# EAGLE design LoRa Gateway ESP32 - Final (EAGLE 9.4.2)
COMPANY: ADAFRUIT INDUSTRIES; DRAWN: KTOWN; REV: B

## Sheet 1 of 2: ESP
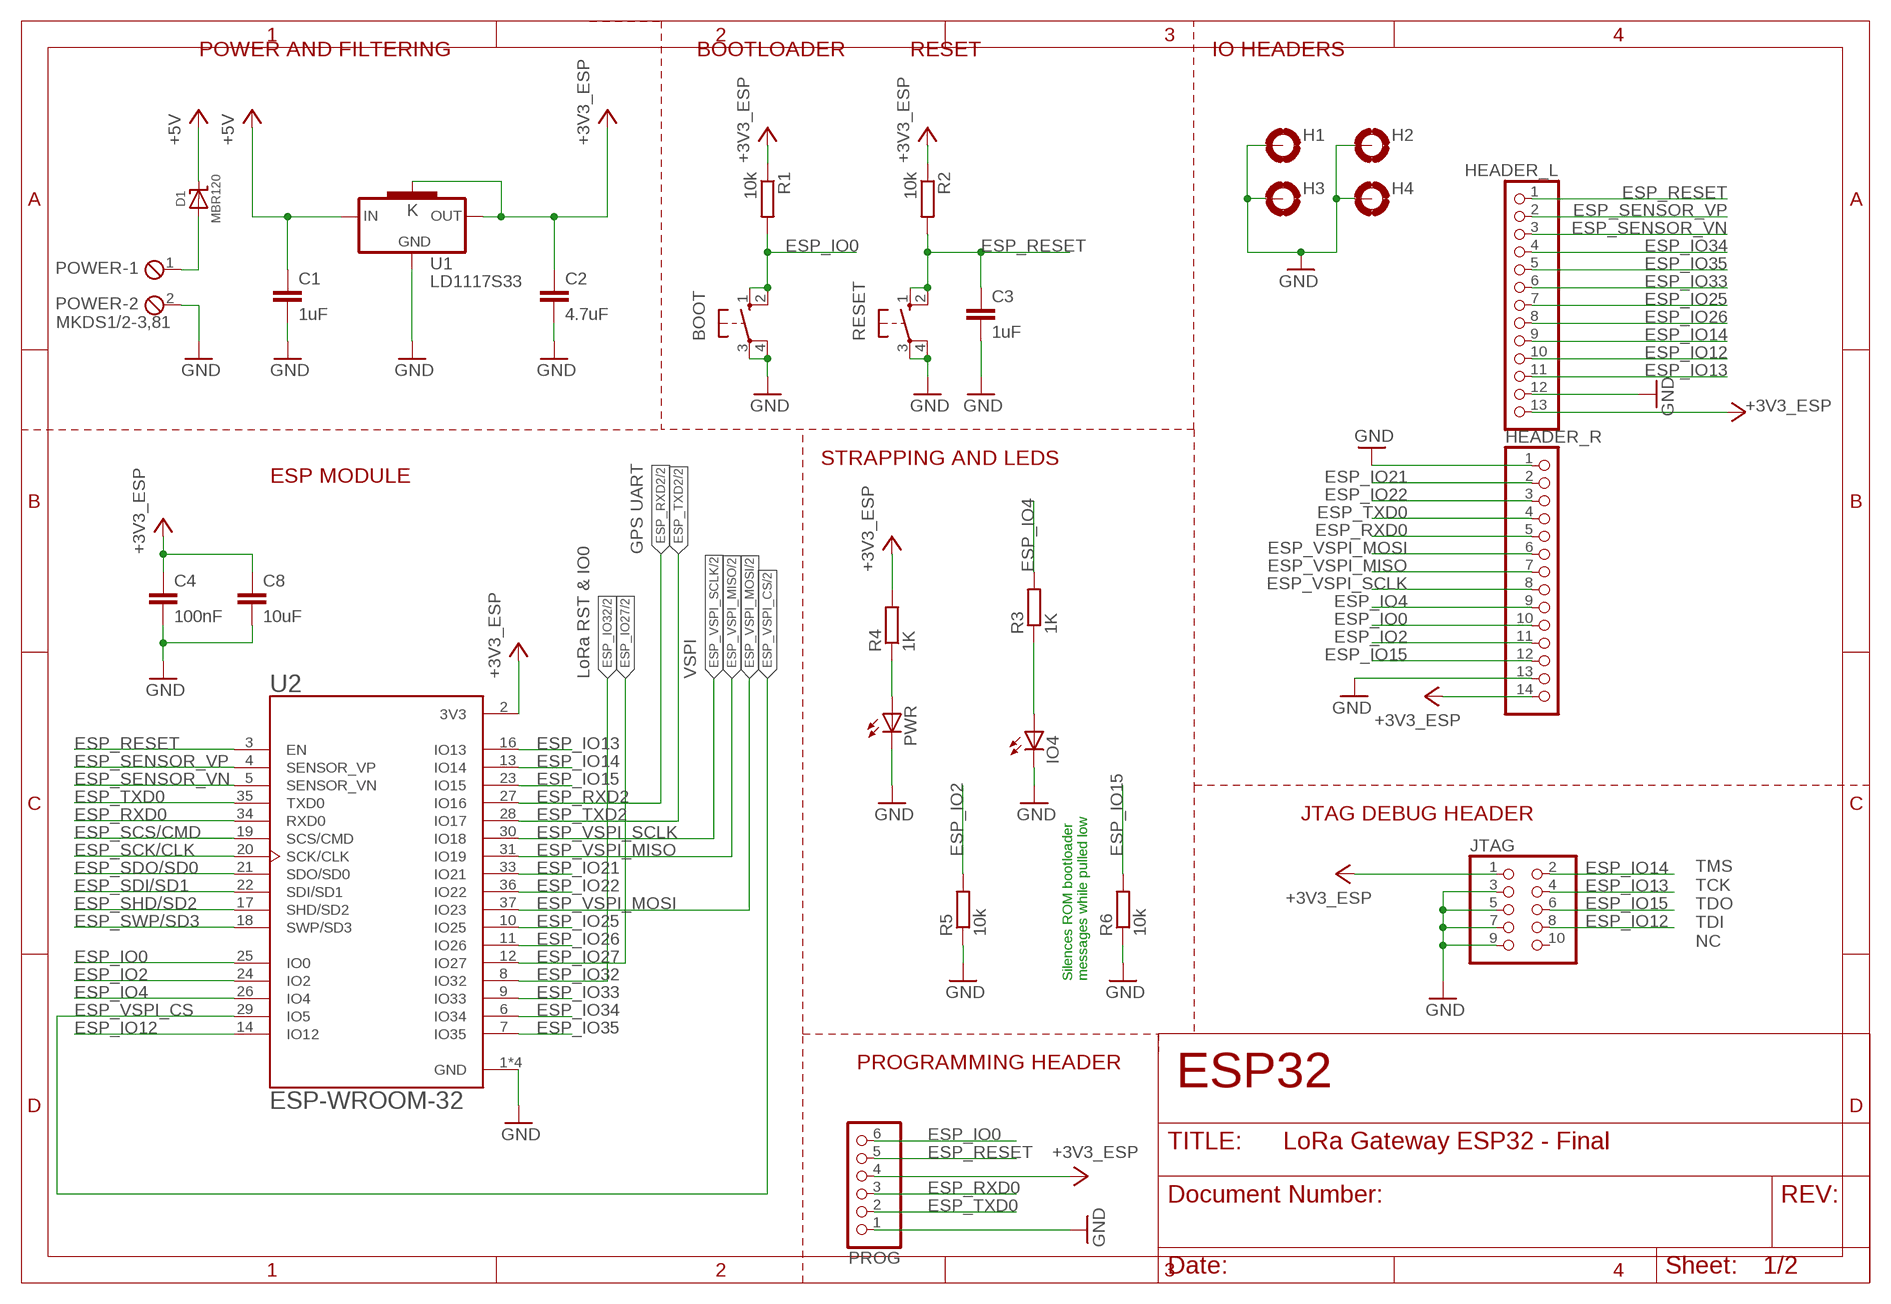
[diagram p0: schematic, sheet 1]

### Parts
BOOT  10-XX  [B3F-10XX]
C1  1uF  C-EUC0805K  [C0805K]
C2  4.7uF  C-EUC0805K  [C0805K]
C3  1uF  C-EUC0805K  [C0805K]
C4  100nF  C-EUC0805K  [C0805K]
C8  10uF  C-EUC0805K  [C0805K]
D1  MBR120  DIODE-SCHOTTKYSOD-123  [SOD-123]
H1  MOUNT-PAD-ROUND3.2  [3,2-PAD]
H2  MOUNT-PAD-ROUND3.2  [3,2-PAD]
H3  MOUNT-PAD-ROUND3.2  [3,2-PAD]
H4  MOUNT-PAD-ROUND3.2  [3,2-PAD]
HEADER_L  PINHD-1X13  [1X13]
HEADER_R  PINHD-1X14  [1X14]
IO4  LEDCHIP-LED0805  [CHIP-LED0805]
JTAG  PINHD-2X5  [2X05]
POWER  MKDS1/2-3,81  [2POL381]
PROG  PINHD-1X6  [1X06]
PWR  LEDCHIP-LED0805  [CHIP-LED0805]
R1  10k  R-EU_R0805  [R0805]
R2  10k  R-EU_R0805  [R0805]
R3  1K  R-EU_R0805  [R0805]
R4  1K  R-EU_R0805  [R0805]
R5  10k  R-EU_R0805  [R0805]
R6  10k  R-EU_R0805  [R0805]
RESET  10-XX  [B3F-10XX]
U1  LD1117S33  [SOT223]
U2  ESP-WROOM-32  [MODULE_ESP-WROOM-32]

### Nets
+3V3_ESP: C2.1 C4.1 C8.1 HEADER_L.13 HEADER_R.14 JTAG.1 PROG.4 R1.1 R2.1 R4.2 U1.2(OUT) U1.4(K) U2.2(3V3) ; also sheet 2
+5V: C1.1 D1.C U1.3(IN)
ESP_IO0: BOOT.1(S) BOOT.2(S1) HEADER_R.10 PROG.6 R1.2 U2.25(IO0)
ESP_IO2: HEADER_R.11 R5.2 U2.24(IO2)
ESP_IO4: HEADER_R.9 R3.2 U2.26(IO4)
ESP_IO12: HEADER_L.10 JTAG.8 U2.14(IO12)
ESP_IO13: HEADER_L.11 JTAG.4 U2.16(IO13)
ESP_IO14: HEADER_L.9 JTAG.2 U2.13(IO14)
ESP_IO15: HEADER_R.12 JTAG.6 R6.2 U2.23(IO15)
ESP_IO21: HEADER_R.2 U2.33(IO21)
ESP_IO22: HEADER_R.3 U2.36(IO22)
ESP_IO25: HEADER_L.7 U2.10(IO25)
ESP_IO26: HEADER_L.8 U2.11(IO26)
ESP_IO27: U2.12(IO27) ; also sheet 2
ESP_IO32: U2.8(IO32) ; also sheet 2
ESP_IO33: HEADER_L.6 U2.9(IO33)
ESP_IO34: HEADER_L.4 U2.6(IO34)
ESP_IO35: HEADER_L.5 U2.7(IO35)
ESP_RESET: C3.1 HEADER_L.1 PROG.5 R2.2 RESET.1(S) RESET.2(S1) U2.3(EN)
ESP_RXD0: HEADER_R.5 PROG.3 U2.34(RXD0)
ESP_RXD2: U2.27(IO16) ; also sheet 2
ESP_SCK/CLK: U2.20(SCK/CLK)
ESP_SCS/CMD: U2.19(SCS/CMD)
ESP_SDI/SD1: U2.22(SDI/SD1)
ESP_SDO/SD0: U2.21(SDO/SD0)
ESP_SENSOR_VN: HEADER_L.3 U2.5(SENSOR_VN)
ESP_SENSOR_VP: HEADER_L.2 U2.4(SENSOR_VP)
ESP_SHD/SD2: U2.17(SHD/SD2)
ESP_SWP/SD3: U2.18(SWP/SD3)
ESP_TXD0: HEADER_R.4 PROG.2 U2.35(TXD0)
ESP_TXD2: U2.28(IO17) ; also sheet 2
ESP_VSPI_CS: U2.29(IO5) ; also sheet 2
ESP_VSPI_MISO: HEADER_R.7 U2.31(IO19) ; also sheet 2
ESP_VSPI_MOSI: HEADER_R.6 U2.37(IO23) ; also sheet 2
ESP_VSPI_SCLK: HEADER_R.8 U2.30(IO18) ; also sheet 2
GND: BOOT.3(P) BOOT.4(P1) C1.2 C2.2 C3.2 C4.2 C8.2 H1.B3,2(MOUNT) H2.B3,2(MOUNT) H3.B3,2(MOUNT) H4.B3,2(MOUNT) HEADER_L.12 HEADER_R.1 HEADER_R.13 IO4.C JTAG.3 JTAG.5 JTAG.7 JTAG.9 POWER.2 PROG.1 PWR.C R5.1 R6.1 RESET.3(P) RESET.4(P1) U1.1(GND) U2.1(GND) U2.1.1(GND) U2.15(GND) U2.38(GND) ; also sheet 2
N$2: D1.A POWER.1
N$5: IO4.A R3.1
N$10: PWR.A R4.1
Unconnected: JTAG.10

### Notes on the sheet
- POWER AND FILTERING | BOOTLOADER | RESET | IO HEADERS
- STRAPPING AND LEDS
- ESP MODULE
- GPS UART
- LoRa RST & IO0 | VSPI
- JTAG DEBUG HEADER
- TMS
  TCK
  TDO
  TDI
  NC
- Silences ROM bootloader
  messages while pulled low
- PROGRAMMING HEADER
- ESP32

## Sheet 2 of 2: Lora and GPS
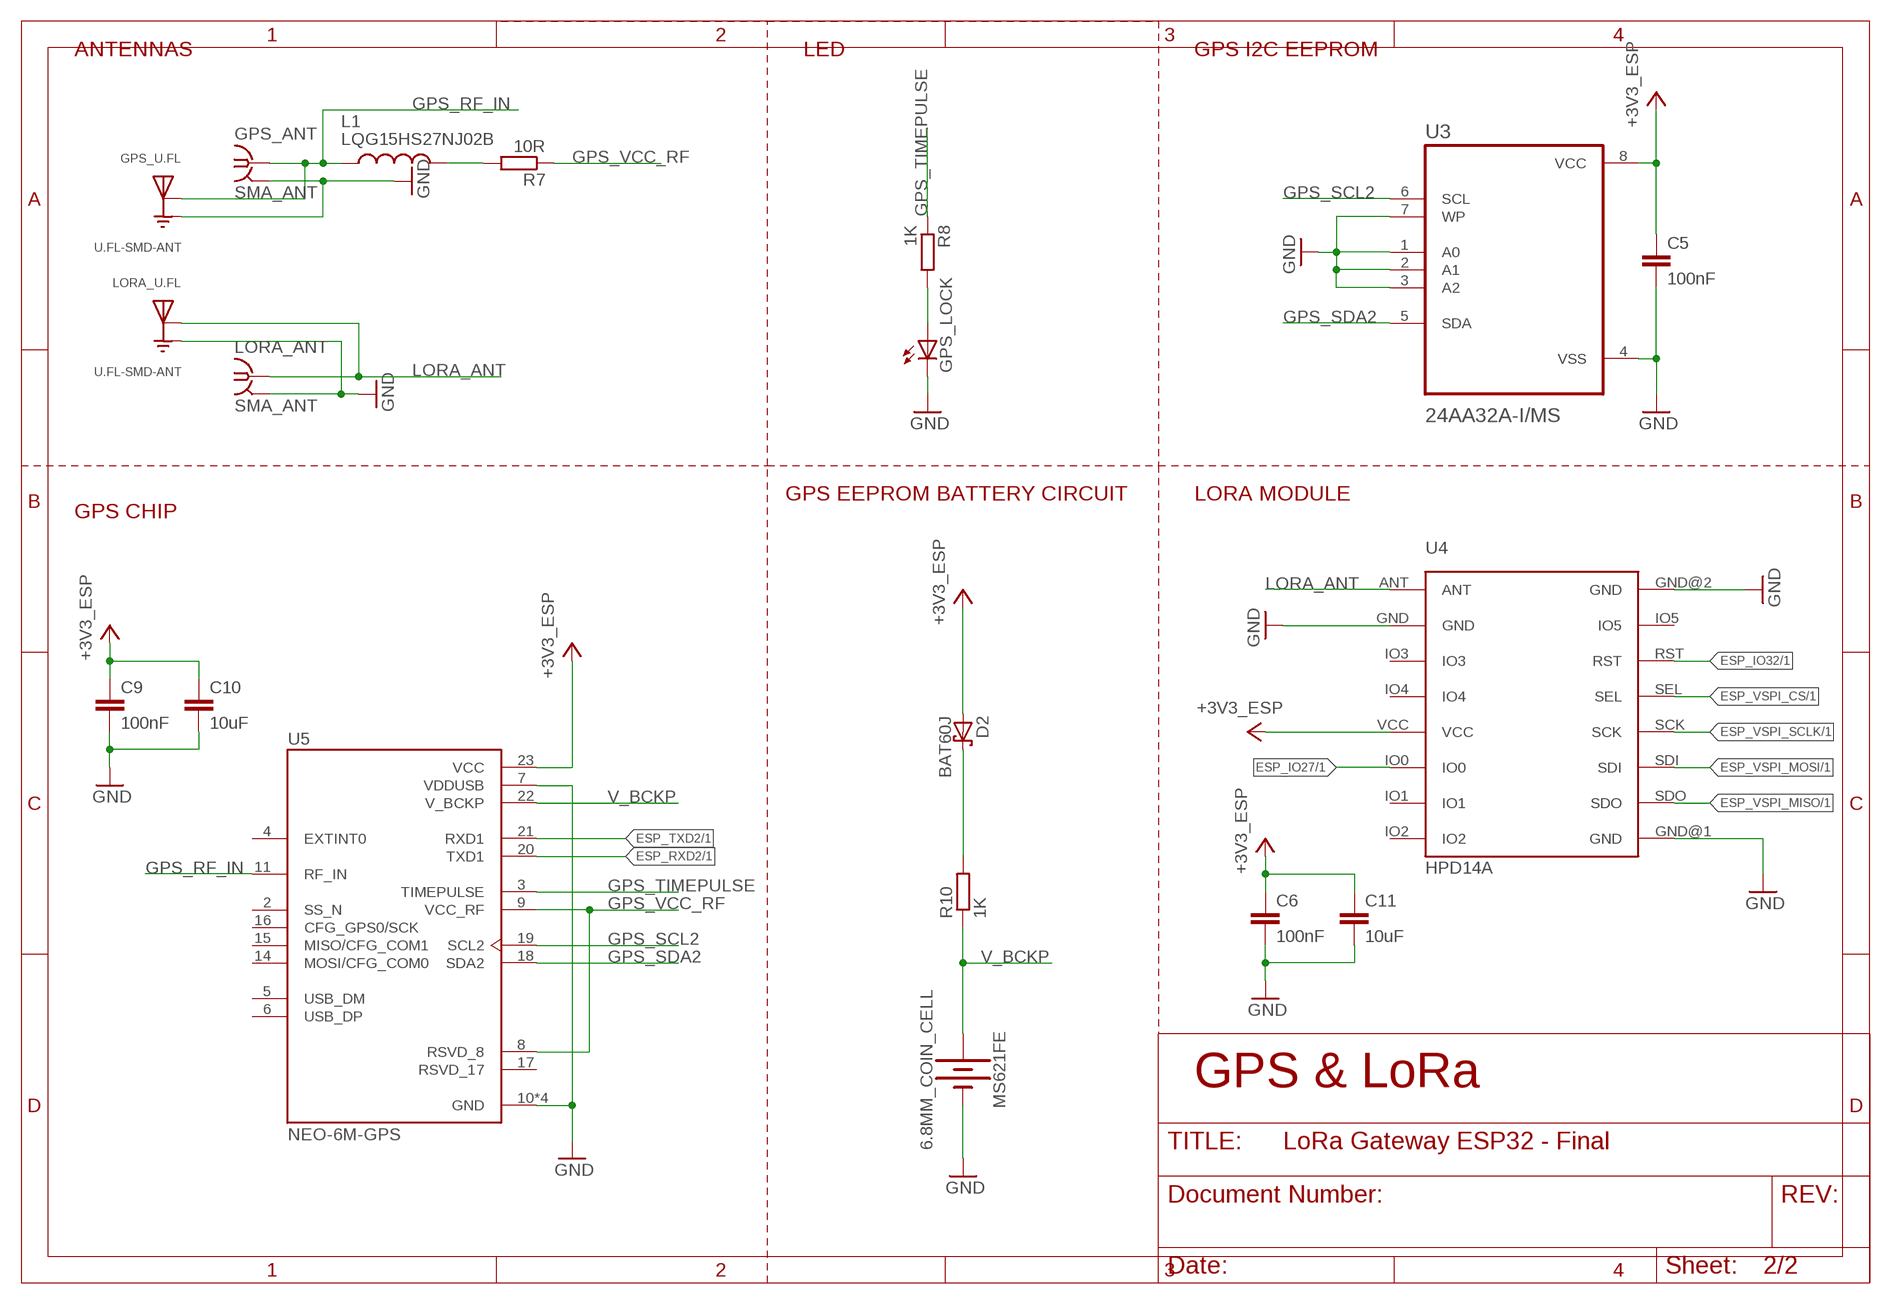
[diagram p1: schematic, sheet 2]

### Parts
C5  100nF  C-EUC0805K  [C0805K]
C6  100nF  C-EUC0805K  [C0805K]
C9  100nF  C-EUC0805K  [C0805K]
C10  10uF  C-EUC0805K  [C0805K]
C11  10uF  C-EUC0805K  [C0805K]
D2  BAT60J  [SOD323_ST]
GPS_ANT  SMA_ANT  [BU-SMA-H]
GPS_LOCK  LEDCHIP-LED0805  [CHIP-LED0805]
GPS_U.FL  U.FL-SMD-ANT  [HRS_U.FL-R-SMT-1(10)]
L1  LQG15HS27NJ02B  [INDC1005X55N]
LORA_ANT  SMA_ANT  [BU-SMA-H]
LORA_U.FL  U.FL-SMD-ANT  [HRS_U.FL-R-SMT-1(10)]
MS621FE  6.8MM_COIN_CELL  BATTERY-6.8MM_SMD  [BATTCON-6.8MM]
R7  10R  R-EU_R0805  [R0805]
R8  1K  R-EU_R0805  [R0805]
R10  1K  R-EU_R0805  [R0805]
U3  24AA32A-I/MS  [SOP65P490X110-8N]
U4  HPD14A  [HPD14A]
U5  NEO-6M-GPS  [XCVR_NEO-6M-GPS]

### Nets
+3V3_ESP: C5.1 C6.1 C9.1 C10.1 C11.1 D2.A U3.8(VCC) U4.VCC U5.23(VCC) ; also sheet 1
ESP_IO27: U4.IO0 ; also sheet 1
ESP_IO32: U4.RST ; also sheet 1
ESP_RXD2: U5.20(TXD1) ; also sheet 1
ESP_TXD2: U5.21(RXD1) ; also sheet 1
ESP_VSPI_CS: U4.SEL ; also sheet 1
ESP_VSPI_MISO: U4.SDO ; also sheet 1
ESP_VSPI_MOSI: U4.SDI ; also sheet 1
ESP_VSPI_SCLK: U4.SCK ; also sheet 1
GND: C5.2 C6.2 C9.2 C10.2 C11.2 GPS_ANT.2 GPS_ANT.3 GPS_ANT.4 GPS_ANT.5 GPS_LOCK.C GPS_U.FL.1(GND) GPS_U.FL.3(GND) LORA_ANT.2 LORA_ANT.3 LORA_ANT.4 LORA_ANT.5 LORA_U.FL.1(GND) LORA_U.FL.3(GND) MS621FE.- U3.1(A0) U3.2(A1) U3.3(A2) U3.4(VSS) U3.7(WP) U4.GND U4.GND@1(GND) U4.GND@2(GND) U5.7(VDDUSB) U5.10(GND) U5.12(GND) U5.13(GND) U5.24(GND) ; also sheet 1
GPS_RF_IN: GPS_ANT.1 GPS_U.FL.2(SIG) L1.1 U5.11(RF_IN)
GPS_SCL2: U3.6(SCL) U5.19(SCL2)
GPS_SDA2: U3.5(SDA) U5.18(SDA2)
GPS_TIMEPULSE: R8.1 U5.3(TIMEPULSE)
GPS_VCC_RF: R7.1 U5.8(RSVD_8) U5.9(VCC_RF)
LORA_ANT: LORA_ANT.1 LORA_U.FL.2(SIG) U4.ANT
N$14: GPS_LOCK.A R8.2
N$16: L1.2 R7.2
N$17: D2.C R10.2
V_BCKP: MS621FE.+ R10.1 U5.22(V_BCKP)
Unconnected: U4.IO1 U4.IO2 U4.IO3 U4.IO4 U4.IO5 U5.2(SS_N) U5.4(EXTINT0) U5.5(USB_DM) U5.6(USB_DP) U5.14(MOSI/CFG_COM0) U5.15(MISO/CFG_COM1) U5.16(CFG_GPS0/SCK) U5.17(RSVD_17)

### Notes on the sheet
- ANTENNAS | LED | GPS I2C EEPROM
- GPS EEPROM BATTERY CIRCUIT | LORA MODULE
- GPS CHIP
- GPS & LoRa

## Library data of the parts
BOOT RESET = LoRa Gateway ESP32 - Final:10-XX: OMRON SWITCH; MPN: B3F-1000; OC_FARNELL: 176432; OC_NEWARK: 36M3542
C1-C6 C8-C11 = LoRa Gateway ESP32 - Final:C-EU: CAPACITOR, European symbol
D1 = LoRa Gateway ESP32 - Final:DIODE-SCHOTTKY
D2 = LoRa Gateway ESP32 - Final:BAT60J: Schottky barrier diode Source: www.st.com, BAT60J.pdf
GPS_ANT LORA_ANT = LoRa Gateway ESP32 - Final:SMA_ANT: FEMALE SMA CONNECTOR Radiall; OC_FARNELL: unknown; OC_NEWARK: unknown
GPS_LOCK IO4 PWR = LoRa Gateway ESP32 - Final:LED: LED OSRAM: - CHIPLED LG R971, LG N971, LY N971, LG Q971, LY Q971, LO R971, LY R971 LH N974, LH R974 LS Q976, LO Q976, LY Q976 LO Q996 - Hyper CHIPLED LW Q18S LB Q993, LB Q99A, LB R99A - SideLED LS A670, LO A670, LY A670, LG A670, LP A670 LB A673, LV A673, LT A673, LW A673 LH A674 LY A675 LS A676, LA A676, LO A676, LY A676, LW A676 LS A679, LY A679, LG A679 - Hyper Micro SIDELED® LS Y876, LA Y876, LO Y876, LY Y876 LT Y87S - SmartLED LW L88C, LW L88S LB L89C, LB L89S, LG L890 LS L89K, LO L89K, LY L89K LS L896, LA L896, LO L896, LY L896 - TOPLED LS T670, LO T670, LY T670, LG T670, LP T670 LSG T670, LSP T670, LSY T670, LOP T670, LYG T670 LG T671, LOG T671, LSG T671 LB T673, LV T673, LT T673, LW T673 LH T674 LS T676, LA T676, LO T676, LY T676, LB T676, LH T676, LSB T676, LW T676 LB T67C, LV T67C, LT T67C, LS T67K, LO T67K, LY T67K, LW E67C LS E67B, LA E67B, LO E67B, LY E67B, LB E67C, LV E67C, LT E67C LW T67C LS T679, LY T679, LG T679 LS T770, LO T770, LY T770, LG T770, LP T770 LB T773, LV T773, LT T773, LW T773 LH T774 LS E675, LA E675, LY E675, LS T675 LS T776, LA T776, LO T776, LY T776, LB T776 LHGB T686 LT T68C, LB T68C - Hyper Mini TOPLED® LB M676 - Mini TOPLED Santana® LG M470 LS M47K, LO M47K, LY M47K Source: http://www.osram.convergy.de LUXEON: - LUMILED® LXK2-PW12-R00, LXK2-PW12-S00, LXK2-PW14-U00, LXK2-PW14-V00 LXK2-PM12-R00, LXK2-PM12-S00, LXK2-PM14-U00 LXK2-PE12-Q00, LXK2-PE12-R00, LXK2-PE12-S00, LXK2-PE14-T00, LXK2-PE14-U00 LXK2-PB12-K00, LXK2-PB12-L00, LXK2-PB12-M00, LXK2-PB14-N00, LXK2-PB14-P00, LXK2-PB14-Q00 LXK2-PR12-L00, LXK2-PR12-M00, LXK2-PR14-Q00, LXK2-PR14-R00 LXK2-PD12-Q00, LXK2-PD12-R00, LXK2-PD12-S00 LXK2-PH12-R00, LXK2-PH12-S00 LXK2-PL12-P00, LXK2-PL12-Q00, LXK2-PL12-R00 Source: www.luxeon.com KINGBRIGHT: KA-3528ASYC Source: www.kingbright.com
GPS_U.FL LORA_U.FL = LoRa Gateway ESP32 - Final:U.FL-SMD-ANT: U.FL Series 6 Ghz 50 Ohm Ultra-small SMT Coaxial Cable Receptacle Check prices <https://pricing.snapeda.com/parts/U.FL-R-SMT-1%2810%29/Hirose/view-part?ref=eda>; AVAILABILITY: Warning; DESCRIPTION: U.FL (UMCC) Connector Receptacle, Male Pin 50Ohm Surface Mount Solder; MF: Hirose; MP: U.FL-R-SMT-1(10); PACKAGE: None; PRICE: None; PURCHASE-URL: https://pricing.snapeda.com/search/part/U.FL-R-SMT-1(10)/?ref=eda
H1-H4 = LoRa Gateway ESP32 - Final:MOUNT-PAD-ROUND: MOUNTING PAD, round
HEADER_L = pinhead:PINHD-1X13: PIN HEADER
HEADER_R = pinhead:PINHD-1X14: PIN HEADER
JTAG = LoRa Gateway ESP32 - Final:PINHD-2X5: PIN HEADER
L1 = LoRa Gateway ESP32 - Final:LQG15HS27NJ02B; AVAILABILITY: Unavailable; DESCRIPTION: Inductor with Inductance: 27nH Tol. +/-5%, Package: 0402 (1005); MF: Murata; MP: LQG15HS27NJ02B; PACKAGE: 1005 Murata; PRICE: None
MS621FE = LoRa Gateway ESP32 - Final:BATTERY: Battery - Single Cell A variety of battery chemistries, sizes, and footprints. Device List: 20MM_PTH - Coin Cell Battery Holder - 20mm (PTH) <https://www.sparkfun.com/products/783> 20MM_PTH_KIT- Coin Cell battery Holder - 20 mm (PTH) <http://www.sparkfun.com/products/783>kit version with special mask 6.8MM_PTH - Coin Cell Battery Holder - 6.8MM(SMD) <https://www.digikey.com/product-detail/en/seiko-instruments/MS621FE-FL11E/728-1057-ND/1889208?WT.srch=1&gclid=CNOQ5a6LzdQCFZS2wAodXCkE0g> 12MM_SMD - Coin Cell Battery Holder - 12mm (SMD) <https://www.sparkfun.com/products/10592> 12MM_PTH - Coin Cell Battery Holder - 12mm (PTH) <https://www.sparkfun.com/products/7948> 20MM_SMD - 20mm Coin Cell Battery Holder (SMD) (2 legs) Used on the Big Time Watch Kit <https://www.sparkfun.com/products/11734> 20MM_SMD_4LEGS - Coin Cell Battery Holder - 20mm (SMD) <https://www.sparkfun.com/products/11892> 20MM_SMD_4LEGS_OVERPASTE - Coin Cell Battery Holder - 20mm (SMD) <https://www.sparkfun.com/products/11892> (Over-paste on the legs) 24.5MM_PTH - Coin Cell Battery Holder - 24.5mm (PTH) <https://www.sparkfun.com/products/8863> 9V - 9V Battery Holder - PC Mount Used on the SparkFun SparkPunk Sound Kit <https://www.sparkfun.com/products/11177> and SparkFun SparkPunk Sequencer Kit <https://www.sparkfun.com/products/12707> 18650 - Battery Holder - 18650 (PTH) <https://www.sparkfun.com/products/13113> AA - Battery Holder - 1xAA (PTH) <https://www.sparkfun.com/products/7949> AAA - Battery Holder - 1xAAA (PTH) <https://www.sparkfun.com/products/12718> AA_KIT - Battery Holder - 1xAA (PTH) <https://www.sparkfun.com/products/7949> Special kit package - pads only have exposed copper on one side of the board. AAA_KIT - Battery Holder - 1xAAA (PTH) <https://www.sparkfun.com/products/12718> Special kit package - pads only have exposed copper on one side of the board.; PROD_ID: BATT-08316; SF_SKU: PRT-07949
POWER = LoRa Gateway ESP32 - Final:MKDS1/2-3,81: MKDS 1/2-3,81 - Order No. 1727010 (RS-Online - 101-5384) Pitch: 3,81mm Number of terminals: 2 Rated Voltage: 160V Maximum load current/ cross section: 12A/1.5mm2-AWG16 Housing Interlocking: none Color: Green
PROG = pinhead:PINHD-1X6: PIN HEADER
R1-R8 R10 = LoRa Gateway ESP32 - Final:R-EU_: RESISTOR, European symbol
U1 = LoRa Gateway ESP32 - Final:LD1117S33: VOLTAGE REGULATOR SMD 3,3V; AVAILABILITY: Unavailable; DESCRIPTION: Linear Voltage Regulator IC 1 Output 800mA SOT-223; MF: STMicroelectronics; MP: LD1117S33; PACKAGE: TO-261-4 STMicroelectronics; PRICE: None
U2 = LoRa Gateway ESP32 - Final:ESP-WROOM-32: Module: combo; GPIO, I2C x2, I2S x2, SDIO, SPI x3, UART x3; 19.5dBm Check prices <https://pricing.snapeda.com/parts/ESP-WROOM-32/Olimex%20LTD/view-part?ref=eda>; AVAILABILITY: Bad; DESCRIPTION: WiFi 802.11b/g/n/d/e/i Transceiver Module 2.4GHz Surface Mount; MF: Olimex LTD; MP: ESP-WROOM-32; PACKAGE: Module Olimex LTD; PRICE: None
U3 = LoRa Gateway ESP32 - Final:24AA32A-I/MS; AVAILABILITY: Unavailable; DESCRIPTION: EEPROM Memory IC 32Kb (4K x 8) I²C 400kHz 900ns 8-MSOP; MF: Microchip; MP: 24AA32A-I/MS; PACKAGE: MSOP-8 Microchip; PRICE: None
U4 = LoRa Gateway ESP32 - Final:HPD14A: LoRa SX1278 module HPD14A
U5 = LoRa Gateway ESP32 - Final:NEO-6M-GPS: SMD GPS Module; AVAILABILITY: Unavailable; DESCRIPTION: SMD GPS Module;; MF: u-blox; MP: NEO-6M-GPS; PACKAGE: None; PRICE: None

## Board
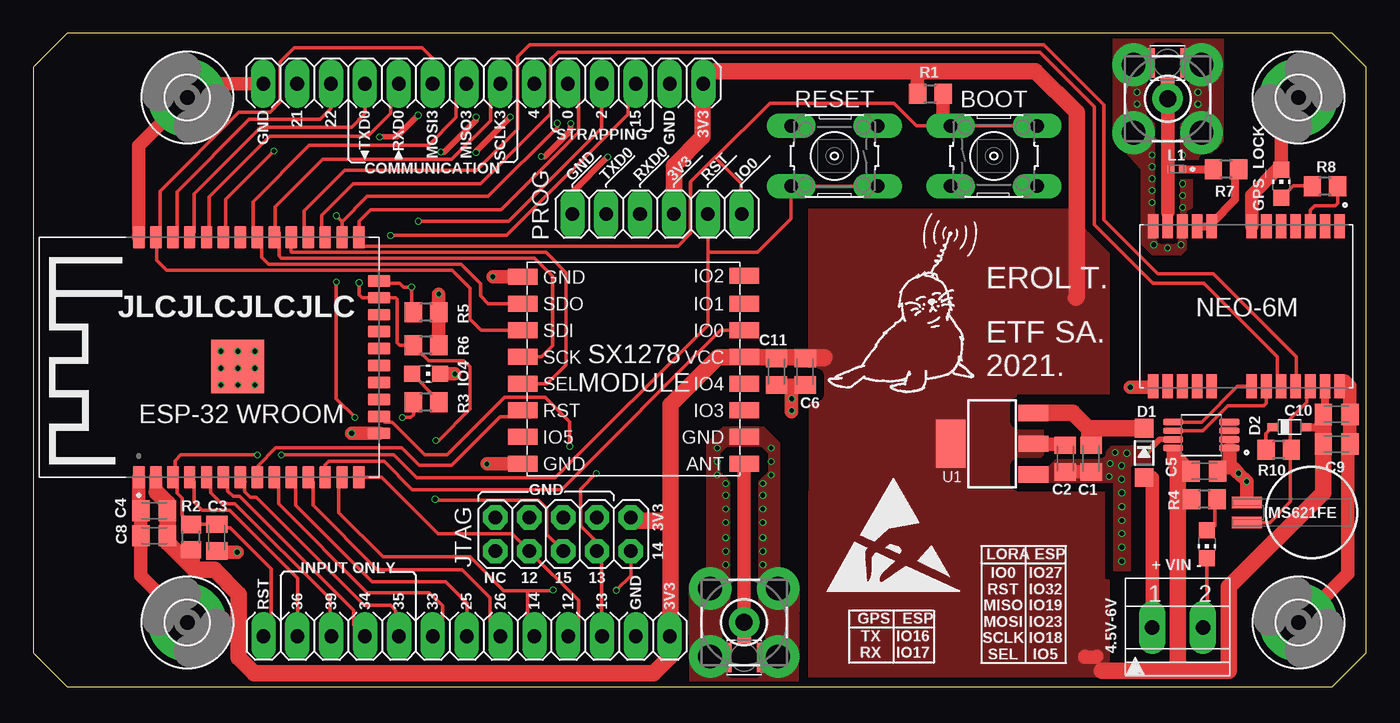
[diagram p2: board, top side]
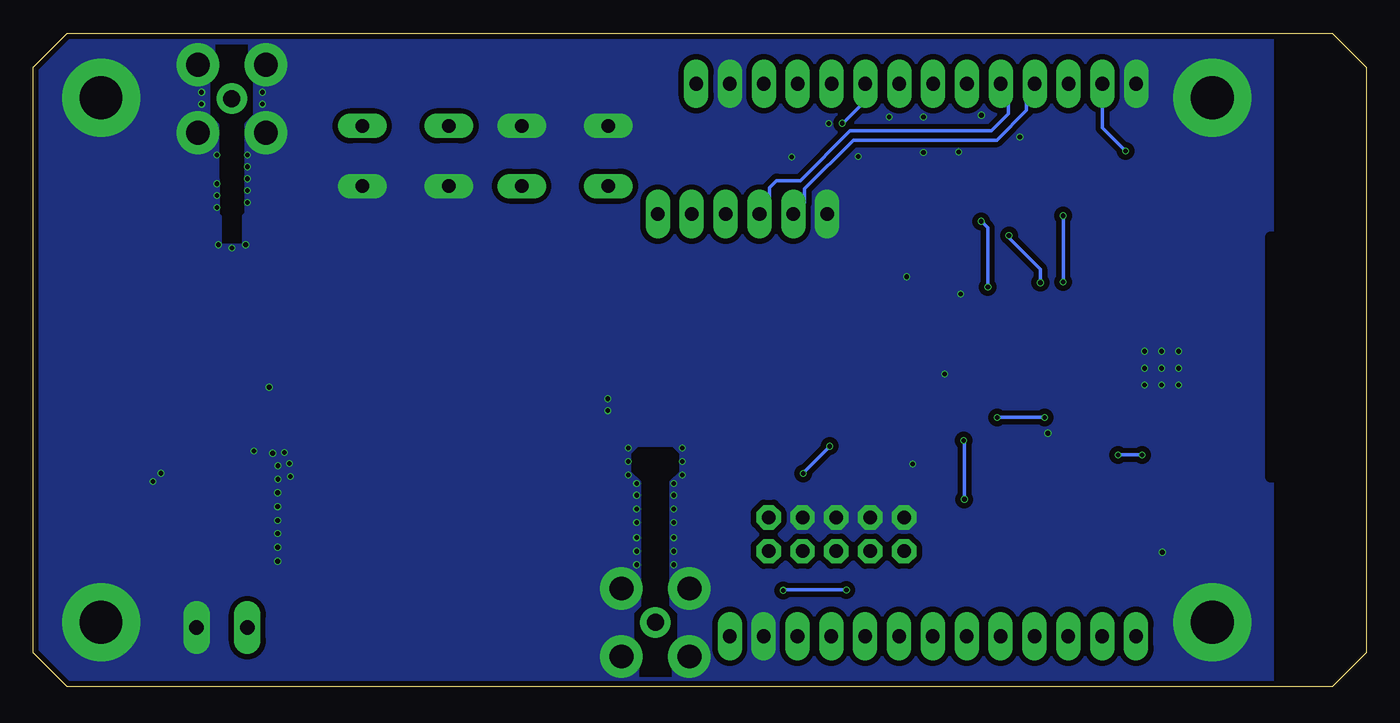
[diagram p3: board, bottom side, seen from below]

Size 100 x 49 mm. Coordinates in mm from the lower left corner, seen from the top.
Outline: 2.54,0 97.46,0 100,2.54 100,46.46 97.46,49 2.54,49 0,46.46 0,2.54 2.54,0
Copper layers (1*16): Top 0.035mm / dielectric 1.6mm / Bottom 0.035mm
Design rules "jlcpcb-2layers *": minimum track width 5mil, minimum drill 0.3mm, track to track 5mil, track to pad 5mil, pad to pad 5mil, via to via 5mil, smd to smd 5mil, copper to edge 0.2mm, drill to drill 6mil, minimum pad ring 10mil, minimum via ring 3mil, stop-mask expansion 4mil, vias tented up to drill 20mil, thermal gap 10mil

### Footprints (pad centres in the part's own frame; a part is rotated, then mirrored left to right if it is on the bottom)
B3F-10XX = drill 1.016 long: 1 -3.251,2.261; 2 3.251,2.261; 3 -3.251,-2.261; 4 3.251,-2.261
C0805K = smd 1.3 x 1.6: 1 -1,0; 2 1,0
SOD-123 = smd 1.4 x 1.4: A 1.85,0; C -1.85,0
SOD323_ST = smd 0.8 x 0.6: A 1.25,0; C -1.25,0
BU-SMA-H = drill 1.27: 1 0,0 | drill 1.778: 2 -2.55,2.55; 3 2.55,2.55; 4 2.55,-2.55; 5 -2.55,-2.55
CHIP-LED0805 = smd 1.2 x 1.2: A 0,-1.05; C 0,1.05
HRS_U.FL-R-SMT-1(10) = smd 1.05 x 2.2: 1 -1.475,0; 3 1.475,0 | smd 1 x 1.05: 2 0,-1.525
3,2-PAD = drill 3.2 pad 5.842: B3,2 0,0
1X13 = drill 1.016 long: 1 -15.24,0; 2 -12.7,0; 3 -10.16,0; 4 -7.62,0; 5 -5.08,0; 6 -2.54,0; 7 0,0; 8 2.54,0; 9 5.08,0; 10 7.62,0; 11 10.16,0; 12 12.7,0; 13 15.24,0
1X14 = drill 1.016 long: 1 -16.51,0; 2 -13.97,0; 3 -11.43,0; 4 -8.89,0; 5 -6.35,0; 6 -3.81,0; 7 -1.27,0; 8 1.27,0; 9 3.81,0; 10 6.35,0; 11 8.89,0; 12 11.43,0; 13 13.97,0; 14 16.51,0
2X05 = drill 1.016 octagon: 1 -5.08,-1.27; 2 -5.08,1.27; 3 -2.54,-1.27; 4 -2.54,1.27; 5 0,-1.27; 6 0,1.27; 7 2.54,-1.27; 8 2.54,1.27; 9 5.08,-1.27; 10 5.08,1.27
INDC1005X55N = smd 0.54 x 0.6: 1 -0.432,0; 2 0.432,0
BATTCON-6.8MM = smd 2.25 x 0.85: + 4.87,0.75; - 4.87,-0.75
2POL381 = drill 1.1 long: 1 0,0; 2 3.81,0
1X06 = drill 1.016 long: 1 -6.35,0; 2 -3.81,0; 3 -1.27,0; 4 1.27,0; 5 3.81,0; 6 6.35,0
R0805 = smd 1.3 x 1.5: 1 -0.95,0; 2 0.95,0
SOT223 = smd 1.219 x 2.235: 1 -2.311,-3.099; 2 0,-3.099; 3 2.311,-3.099 | smd 3.6 x 2.2: 4 0,3.099
MODULE_ESP-WROOM-32 = smd 1.7 x 0.9: 1 -9,8.255; 2 -9,6.985; 3 -9,5.715; 4 -9,4.445; 5 -9,3.175; 6 -9,1.905; 7 -9,0.635; 8 -9,-0.635; 9 -9,-1.905; 10 -9,-3.175; 11 -9,-4.445; 12 -9,-5.715; 13 -9,-6.985; 14 -9,-8.255; 25 9,-8.255; 26 9,-6.985; 27 9,-5.715; 28 9,-4.445; 29 9,-3.175; 30 9,-1.905; 31 9,-0.635; 32 9,0.635; 33 9,1.905; 34 9,3.175; 35 9,4.445; 36 9,5.715; 37 9,6.985; 38 9,8.255 | smd 4 x 4: 1.1 -0.7,0.845 | smd 0.9 x 1.7: 15 -5.715,-9.755; 16 -4.445,-9.755; 17 -3.175,-9.755; 18 -1.905,-9.755; 19 -0.635,-9.755; 20 0.635,-9.755; 21 1.905,-9.755; 22 3.175,-9.755; 23 4.445,-9.755; 24 5.715,-9.755
SOP65P490X110-8N = smd 1.5 x 0.49: 1 -2.105,0.975; 2 -2.105,0.325; 3 -2.105,-0.325; 4 -2.105,-0.975; 5 2.105,-0.975; 6 2.105,-0.325; 7 2.105,0.325; 8 2.105,0.975
HPD14A = smd 2.2 x 1.2: ANT -7.9,6.9; GND -7.9,4.9; GND@1 8.7,-7.1; GND@2 8.7,6.9; IO0 -7.9,-3.1; IO1 -7.9,-5.1; IO2 -7.9,-7.2; IO3 -7.9,2.9; IO4 -7.9,0.9; IO5 8.7,4.9; RST 8.7,2.9; SCK 8.7,-1.1; SDI 8.7,-3.1; SDO 8.7,-5.1; SEL 8.7,0.9; VCC -7.9,-1.1
XCVR_NEO-6M-GPS = smd 1.8 x 0.8: 1 -6,7; 2 -6,5.9; 3 -6,4.8; 4 -6,3.7; 5 -6,2.6; 6 -6,1.5; 7 -6,0.4; 8 -6,-2.6; 9 -6,-3.7; 10 -6,-4.8; 11 -6,-5.9; 12 -6,-7; 13 6,-7; 14 6,-5.9; 15 6,-4.8; 16 6,-3.7; 17 6,-2.6; 18 6,0.4; 19 6,1.5; 20 6,2.6; 21 6,3.7; 22 6,4.8; 23 6,5.9; 24 6,7

### Placement (x,y rotation side)
BOOT  72.07,39.8 0 top
C1  79.36,17.11 270 top
C2  77.42,17.11 270 top
C3  13.77,11.18 270 top
C4  9.07,13.19 180 top
C5  87.86,16.16 0 top
C6  57.91,23.62 270 top
C8  9.07,11.32 180 top
C9  97.78,18.2 0 top
C10  97.78,20.42 0 top
C11  55.75,23.62 270 top
D1  83.34,17.53 270 top
D2  94.24,19.47 0 top
GPS_ANT  85.11,44.1 90 top
GPS_LOCK  93.63,37.71 0 top
GPS_U.FL  85.11,46.77 0 top
H1  94.92,44.17 0 top
H2  11.55,4.83 90 top
H3  94.92,4.83 90 top
H4  11.55,44.17 90 top
HEADER_L  32.51,3.78 0 top
HEADER_R  33.76,45.22 0 top
IO4  29.46,23.46 270 top
JTAG  39.75,11.43 180 top
L1  85.77,38.81 0 top
LORA_ANT  53.33,4.82 270 top
LORA_U.FL  53.33,2.19 180 top
MS621FE  95.9,13.06 180 top
POWER  83.94,4.43 0 top
PROG  46.79,35.44 0 top
PWR  88.06,10.68 180 top
R1  67.3,44.48 0 top
R2  11.83,11.22 90 top
R3  29.46,21.33 180 top
R4  87.86,14.05 180 top
R5  29.46,28.07 180 top
R6  29.46,25.6 180 top
R7  89.48,38.81 180 top
R8  96.91,37.52 180 top
R10  93.43,17.76 180 top
RESET  60.11,39.8 180 top
U1  71.93,18.22 90 top
U2  16.18,24.72 90 top
U3  87.62,18.87 180 top
U4  45.43,23.63 180 top
U5  91,28.53 270 top
U$1  [ESD_10.00]  59.43,7.03 0 top

### Tracks (layer width: path | path; a pad name or v marks a point on that pad's centre or on a via)
+3V3_ESP
  Top 0.152: 12.1,8.75 12.1,10 R2.1
  Top 0.254: 96.74,19.47 96.78,19.51 | 85.52,16.88 85.52,17.5 U3.8
  Top 0.61: U5.23 96.9,20.54 | D2.A 96.74,19.47
  Top 1.016: U1.2 75.07,18.18 77.34,18.18 C2.1 | 85.88,16.46 86.19,16.16 C5.1 85.52,17.5 | 85.51,17.58 85.51,16.88 85.52,16.88 | C10.1 96.9,20.54 | 53.35,24.71 U4.VCC 53.31,24.71 | C4.1 10.09,13.21 10.09,13.74 | 9.24,14.6 9.24,14.7 9.19,14.74 U2.2 | C8.1 10.07,10.78 | 78.89,2.28 78.89,2.21 79.71,2.21 79.78,2.28 | R4.2 86.01,14.05 85.88,14.18 85.85,14.2 | 11.7,10.14 R2.1 12,10.1 12,9.06 | JTAG.1 44.93,12.61 | HEADER_R.14 50.53,45.48 | 78.2,32.3 78.2,29.17 | HEADER_R.14 50.22,45.17 | HEADER_L.13 47.81,3.84 | HEADER_R.14 50.27,46.17 | 66.33,46.17 66.33,44.49 R1.1
  Top 1.219: 85.88,16.46 85.88,14.18 | C10.1 96.78,19.51 C9.1 96.78,14.55 89.7,7.48 89.7,1.19 85.85,1.19 | 53.35,24.71 55.67,24.71 C11.1 55.82,24.69 59.38,24.69 59.31,24.62 C6.1 | C8.1 C4.1 | 10.09,13.74 9.24,14.6 | 85.85,1.19 80.16,1.19 | 85.85,14.2 85.85,1.19 | 53.31,24.71 51.39,24.71 47.81,21.13 47.81,12.45 | HEADER_L.13 47.75,2.21 46.54,1 16.56,1 15.4,2.15 15.4,6.94 13.6,8.75 12.1,8.75 10.07,10.78 | 78.2,29.17 78.28,29.24 78.28,43.07 75.17,46.17 66.33,46.17 50.27,46.17 | PROG.4 48.06,39.06 50.22,41.23 50.22,45.17 | 47.81,12.45 47.81,3.84 | 47.81,12.45 45.09,12.45 JTAG.1
  pour Top (isolate 0.61, rank 2, no thermals): 58.19,14.62 58.23,14.62 58.23,21.94 58.19,21.94 58.19,35.84 80.7,35.84 80.7,21.93 73.71,21.93 73.71,19.71 75.78,19.71 75.78,16.66 73.71,16.66 73.71,14.61 80.71,14.61 80.71,0.72 58.19,0.72
+5V
  Top 0.152: 79.14,19.38 80.26,19.38 79.12,19.38
  Top 1.016: 79.43,18.19 C1.1 79.12,18.34 79.12,19.38
  Top 1.219: 79.18,19.38 80.26,19.38 D1.C | U1.3 77.98,20.53 79.14,19.38
ESP_IO0
  Top 0.254: 76.58,42.06 BOOT.2 BOOT.1 | HEADER_R.10 40.89,44.44 40.89,41.57 35.09,35.77 25.3,35.77 24.43,34.91 U2.25 24.58,33.58 24.2,33.58 24.74,33.03 48.35,33.03 49.32,34 49.32,37.87 51.14,39.69 | 68.67,42.06 BOOT.1 | BOOT.1 66.27,42.06 64.56,43.77 55.26,43.77 51.14,39.66 51.14,39.69 | PROG.6 53.08,35.5 53.08,37.75 51.14,39.69
  Top 1.016: R1.2 68.23,42.5 68.67,42.06
ESP_IO2  (via drill 0.35)
  Top 0.254: 26.15,30.27 25.94,30.27 25.93,30.27 U2.24 26.13,30.24 27.48,30.24 27.77,29.95 28.38,29.95 | HEADER_R.11 42.62,45.19 42.62,41.88 35.64,34.9 v28.88,34.9 | v28.38,29.96 28.38,29.95 | 28.38,29.95 28.38,28.2 R5.2
  Bottom 0.254: v28.88,34.9 28.38,34.41 v28.38,29.96
ESP_IO4  (via drill 0.35)
  Top 0.254: v39.32,42.26 39.32,41.97 34.13,36.78 25.05,36.78 23.16,34.88 | R3.2 28.51,20.39 28.32,20.19 v27.69,20.19 | v24.13,20.19 22.73,21.59 v22.73,30.35 | U2.26 23.16,34.88 | v22.73,35.32 v22.73,35.31 23.16,34.88
  Bottom 0.254: v39.32,42.26 39.26,42.26 38.4,43.11 | 38.4,43.11 | 38.4,43.11 37.58,43.94 HEADER_R.9 | v27.69,20.19 v24.13,20.19 | v22.73,30.35 v22.73,35.32
ESP_IO12
  Top 0.254: 24.76,15.39 U2.14 26.11,15.72 30.37,11.46 35.91,11.46 JTAG.8 40.9,6.47 40.9,4.56 HEADER_L.10
ESP_IO13  (via drill 0.35)
  Top 0.254: U2.16 26.38,19.83 26.91,19.83 29.35,17.39 31.04,17.39 35.35,21.71 38.38,21.71 40.24,19.85 v40.24,18.03 | 42.67,3.88 HEADER_L.11 42.64,3.81 42.64,9.81 JTAG.4 42.29,10.82 41.04,12.08 41.04,14.8 v42.23,15.99
  Bottom 0.254: v42.23,15.99 42.23,16.03 v40.24,18.02 v40.24,18.03
ESP_IO14  (via drill 0.35)
  Top 0.254: U2.13 23.49,15.4 | U2.13 23.16,16.32 | U2.13 22.91,15.46 22.91,13.05 26.23,9.73 32.75,9.73 35.27,7.21 37.07,7.21 | JTAG.2 44.83,8.33 v43.73,7.22 | 38.97,7.29 v39,7.25 39,7.21 37.07,7.21 | HEADER_L.9 37.07,4.3 37.07,7.21
  Bottom 0.254: v43.73,7.22 43.7,7.25 v39,7.25
ESP_IO15  (via drill 0.35)
  Top 0.254: R6.2 28.8,25.31 | v26.8,33.84 35.51,33.84 44.62,42.95 44.62,44.64 HEADER_R.12 | JTAG.6 38.5,11.41 38.5,13.39 37.91,13.98 30.45,13.98 30.37,14.05 v30.15,14.05 | 30.2,18.52 v30.2,18.46 30.4,18.46 32.77,20.83 32.77,23.98 32.3,24.45 29.66,24.45 R6.2 | v24.45,30.3 24.45,29.4 24.68,29.16 U2.23 27.17,29.16 27.29,29.04 27.29,25.81 27.5,25.6 R6.2
  Bottom 0.254: v30.2,18.46 30.15,18.46 v30.15,14.05 | v24.45,30.3 24.45,31.32 26.8,33.68 v26.8,33.84 | v24.45,30.3
ESP_IO21  (via drill 0.35)
  Top 0.254: U2.33 14.44,33.89 14.44,36.57 v18.04,40.17
  Bottom 0.254: HEADER_R.2 19.79,41.92 v18.04,40.17
ESP_IO22
  Top 0.254: 10.62,34.27 10.62,33.88 U2.36 10.78,34.03 10.78,37.12 16.19,42.54 21.51,42.54 22.34,43.37 HEADER_R.3
ESP_IO25
  Top 0.254: U2.10 19.68,15.4 19.68,13.6 25.41,7.87 30.92,7.87 32.54,6.24 32.54,3.81 HEADER_L.7
ESP_IO26
  Top 0.254: 20.95,15.39 U2.11 20.98,15.37 20.98,13.59 25.8,8.77 32.16,8.77 34.27,6.66 34.27,3.89 34.38,3.78 HEADER_L.8
ESP_IO27
  Top 0.254: U2.12 21.89,16.65 22.14,16.9 26.32,16.9 28.43,14.78 39.62,14.78 51.57,26.73 U4.IO0
ESP_IO32
  Top 0.254: 17.13,15.91 16.95,15.73 16.88,15.79 | 16.88,15.79 U2.8 | U4.RST 37.25,20.21 | U4.RST 36.63,20.63 | 16.88,15.79 16.87,15.8 16.87,16.58 18.2,17.91 27.64,17.91 28.95,16.6 31.39,16.6 35.03,20.25 36.25,20.25 U4.RST
ESP_IO33
  Top 0.254: 18.38,15.43 U2.9 18.41,15.4 18.41,13.71 25.06,7.06 29.71,7.06 30.71,6.06 30.71,4.52 HEADER_L.6
ESP_IO34
  Top 0.254: U2.6 14.6,15.4 14.6,14.66 14.99,14.27 15.5,14.27 24.02,5.75 24.02,4.65 HEADER_L.4
ESP_IO35
  Top 0.254: 15.88,15.39 U2.7 15.87,15.4 15.87,14.64 16.28,14.22 16.7,14.22 24.83,6.09 26.8,6.09 27.19,5.71 27.19,4.02 HEADER_L.5 26.85,3.78
ESP_RESET  (via drill 0.35)
  Top 0.254: 10.46,15.19 U2.3 10.64,15.54 | HEADER_L.1 17.84,4.35 17.84,8.83 14.77,11.9 14.05,11.9 C3.1 R2.2 11.15,12.85 11.15,14.13 10.79,14.5 10.79,15.27 10.64,15.41 10.64,15.54 | RESET.1 RESET.2 56.86,35.09 54.34,32.58 50.6,32.58 PROG.5 50.6,27.12 39.16,15.68 28.77,15.68 27.05,17.4 18.62,17.4 v18.61,17.38 | v16.82,17.38 11.06,17.38 10.64,16.96 10.64,15.54
  Bottom 0.254: v16.82,17.38 | v18.61,17.38 v16.82,17.38
ESP_RXD0
  Top 0.254: U2.34 13.18,33.9 13.18,36.74 17.74,41.29 25.09,41.29 26.8,43.01 26.8,44.6 HEADER_R.5
  Bottom 0.254: HEADER_R.5 26.83,44.64 26.83,42.97 28.13,41.67 38.74,41.67 42.46,37.95 44.23,37.95 44.78,37.41 44.78,36.18 PROG.3
ESP_RXD2
  Top 0.254: U5.20 93.32,22.81 93.32,24.75 87.83,30.25 83.97,30.25 79.59,34.63 79.59,43.5 75.5,47.59 39.37,47.59 38.82,47.05 38.82,42.97 33.56,37.71 24,37.71 21.64,35.36 21.64,33.97 U2.27 | 21.6,34.01 U2.27 | U2.27 21.58,34.04
ESP_SENSOR_VN
  Top 0.254: 13.26,15.47 U2.5 13.32,15.41 13.32,14.55 14.15,13.72 15.11,13.72 22.25,6.58 22.25,3.88 HEADER_L.3
ESP_SENSOR_VP
  Top 0.254: U2.4 12.06,15.4 12.06,13.82 12.66,13.22 14.72,13.22 19.82,8.12 19.82,3.8 HEADER_L.2
ESP_TXD0
  Top 0.254: 11.73,34.32 U2.35 12.08,34.06 12.08,36.98 17.07,41.97 23.86,41.97 24.91,43.01 24.91,45.19 HEADER_R.4
  Bottom 0.254: PROG.2 42.14,36.28 42.14,37.34 38.49,41 27.71,41 25.48,43.22 25.48,44.61 HEADER_R.4
ESP_TXD2
  Top 0.254: 94.7,21.94 U5.21 94.75,22.58 94.75,24.73 88.52,30.96 84.37,30.96 80.33,35 80.33,43.64 75.82,48.15 37.22,48.15 36.32,47.25 36.32,41.8 33.25,38.73 23.37,38.73 20.31,35.68 20.31,34.03 | U2.28 20.31,34.03 | 20.31,34.03 20.3,34.04
ESP_VSPI_CS
  Top 0.254: U2.29 19.34,33.73 19.34,32.62 19.39,32.57 38.46,32.57 39.97,31.06 39.97,24.15 38.55,22.73 U4.SEL
ESP_VSPI_MISO
  Top 0.254: HEADER_R.7 31.73,44.46 31.73,42.7 29.64,40.6 20.71,40.6 16.48,36.38 16.48,34.05 U2.31 17.13,33.4 17.13,32.21 17.66,31.68 32.09,31.68 33.55,30.22 33.55,29.31 34.13,28.73 U4.SDO 36.66,28.79
ESP_VSPI_MOSI
  Top 0.254: U2.37 9.19,34.39 | U2.37 9.5,34.03 9.5,37.17 15.42,43.09 17.75,43.09 18.53,43.87 18.53,46.89 19.57,47.93 29.18,47.93 29.97,47.14 29.97,45.23 HEADER_R.6 | 36.63,26.63 U4.SDI 33.59,26.73 32.77,27.55 32.77,29.87 31.41,31.23 9.99,31.23 9.26,31.96 9.26,33.66 U2.37
ESP_VSPI_SCLK
  Top 0.254: U4.SCK 36.78,24.78 | HEADER_R.8 34.29,44.48 34.29,42.45 31.39,39.55 21.72,39.55 18.15,35.98 18.15,33.79 U2.30 18.44,34.07 18.44,32.3 18.61,32.13 37.61,32.13 38.97,30.77 38.97,25.57 38.13,24.73 U4.SCK | U4.SCK 36.86,24.6
GND  (via drill 0.35)
  Top 0.152: v34.03,16.7 34.06,16.73 | v34.48,30.74 34.49,30.74 34.5,30.73 | v56.9,20.7 56.9,20.62 | 83.79,22.46 83.94,22.46 U5.13 | MS621FE.- 91.03,14.23 | v23.89,19
  Top 0.254: POWER.2 88.08,4.75 PWR.C | 83.96,17.88 83.65,17.88 v83.45,17.68 83.45,17.46 | H3.B3,2 94.99,4.83 | U2.1.1 15.2,23.88 v14.08,23.88 | v31.62,23.45 30.51,23.45 IO4.C | R5.1 R6.1 | R5.1 v30.41,29.45 v30.42,29.45
  Top 0.406: U3.7 84.53,18.55 83.45,17.46 | v28.86,42.85 27.24,41.23 v25.99,41.23 | v33.22,42.73 33.22,42.48 30.83,40.09 v30.58,40.09 | v35.78,42.72 33.22,40.16 v33.22,40.07 | v38.12,39.76 38.37,39.76 40.32,41.71 v40.32,42.24 | v43.1,39.73 40.44,37.08 PROG.1
  Top 0.61: 98.14,22.57 98.04,22.57 U5.24 98.76,22.53 98.78,22.51 | C5.2 88.86,16.24
  Top 0.813: C11.2 56.9,22.62
  Top 1.016: 98.78,22.51 C10.2 C9.2 | 98.74,22.51 98.78,22.51 | 98.78,22.51 98.78,22.57 98.43,22.92 | U5.7 91.4,36.87 93.3,38.76 GPS_LOCK.C 93.63,42.88 H1.B3,2 | R6.1 | U2.1 7.92,13.68 8.07,13.54 C4.2 C8.2 8.07,8.3 H2.B3,2 | 36.81,16.73 U4.GND@2 34.06,16.73 | 51.74,2.3 LORA_U.FL.3 | v15.29,10.08 | v15.29,10.08 13.87,10.08 C3.2 | C1.2 C2.2 | 36.71,30.75 U4.GND@1 34.5,30.73 | C9.2 98.81,18.17 | 83.79,22.46 v82.31,22.46 | C9.2 98.63,18.05 98.63,8.47 94.99,4.83 | U2.38 7.92,40.55 H4.B3,2 12.59,45.22 HEADER_R.1 | U2.15 v23.89,19 | C6.2 C11.2 | 89.76,17.86 89.76,16.81 89.11,16.16 C5.2 89.11,16.41 90.01,16.41 v90.42,16 v91.03,15.4 91.03,14.23 | 56.9,20.62 56.9,22.62 | v30.42,29.45 R5.1 30.42,25.46 30.51,25.37 | IO4.C 31.62,23.46
  other vias: 16.62,25.15 16.62,23.88 16.62,22.61 15.35,22.61 15.35,23.88 15.35,25.15 14.08,25.15 14.08,22.61 51.94,14.35 54.74,9.14 54.74,10.16 54.74,11.18 54.74,14.35 51.94,15.24 54.74,15.24 83.95,38.1 83.95,38.99 83.95,39.88 83.95,36.32 86.23,36.83 86.23,35.94 86.23,39.88 80.78,16.73 80.72,15.76 81.65,16.57 81.65,15.55 82.05,17.5 81.67,12.46 81.67,13.5 81.67,14.54 51.94,9.14 51.94,10.16 51.94,11.18 54.74,12.32 54.74,13.34 51.94,12.32 51.94,13.34 55.37,15.88 55.37,16.89 51.31,15.88 51.31,16.89 81.17,17.56 82.8,44.58 82.8,43.69 87.38,44.58 87.38,43.69 84.07,33.15 85.09,32.89 86.11,33.15 86.23,37.72 83.95,37.21 51.31,17.91 55.37,17.91 56.9,21.59 81.67,9.41 81.67,10.45 81.67,11.49
  pour Top (isolate 0.406, no thermals): 84.01,32.45 83.21,33.25 83.21,38.85 81.09,41.14 81.09,48.78 89.21,48.78 89.18,40.92 86.87,38.69 86.87,35.95 86.47,35.54 86.43,32.79 86.09,32.45
  pour Top (isolate 0.406, no thermals): 51.77,19.37 50.62,18.22 50.62,8.94 49.3,7.62 49.36,0.03 57.3,0.03 57.38,7.37 55.9,8.85 55.9,18.24 54.77,19.37
  pour Top (isolate 0.305, no thermals): 75.92,15.37 83.81,15.37 83.81,17.98 80.89,17.99 80.06,16.98 76.71,16.98 75.92,16.18
  pour Top (no thermals): 89.17,20.03 90.22,20.03 90.22,16.93 89.17,16.93
  pour Top (isolate 0.305): 81.16,15.38 81.16,8.76 82.22,8.76 82.22,15.38
  pour Bottom (isolate 0.406, no thermals): 7.06,52.16 97.26,52.16 102.93,46.48 102.93,3.32 95.06,-4.55 7.06,-4.55
  cutout Bottom (no thermals): 51.57,17.48 52.03,17.94 54.64,17.94 55.12,17.46 55.12,16.13 54.38,15.39 54.38,6.03 54.9,5.51 54.9,3.22 54.51,2.84 54.51,0.73 52.13,0.73 52.13,2.9 51.71,3.32 51.71,5.48 52.29,6.06 52.29,15.39 51.57,16.11
  cutout Bottom (no thermals): 84.35,33.26 85.84,33.26 85.84,35.32 86,35.48 86,38.03 86.03,38.13 86.03,42.19 86.71,42.87 86.71,45.48 86.32,45.87 86.32,48.13 83.9,48.13 83.9,45.85 83.55,45.5 83.55,42.9 84.19,42.26 84.19,35.54 84.35,35.35
  cutout Top (no thermals): 84.35,33.26 85.84,33.26 85.84,35.32 86,35.48 86,38.03 86.03,38.13 86.03,42.19 86.71,42.87 86.71,45.48 86.32,45.87 86.32,47.87 83.9,47.87 83.9,45.85 83.55,45.5 83.55,42.9 84.19,42.26 84.19,35.54 84.35,35.35
  cutout Top (no thermals): 51.57,17.48 52.03,17.94 54.64,17.94 55.12,17.46 55.12,16.13 54.38,15.39 54.38,6.03 54.9,5.51 54.9,3.22 54.51,2.84 54.51,1.11 52.13,1.11 52.13,2.9 51.71,3.32 51.71,5.48 52.29,6.06 52.29,15.39 51.57,16.11
GPS_RF_IN
  Top 0.254: L1.1 85.14,38.81 85.11,38.84 | U5.11 85.1,34.56 85.11,34.56
  Top 0.813: 85.11,34.56 85.11,35.59
  Top 1.016: 85.11,38.84 GPS_ANT.1 GPS_U.FL.2 | 85.11,35.59 85.11,38.84
GPS_SCL2
  Top 0.254: U3.6 87.74,19.2 89.61,21.06 92.32,21.06 92.5,21.25 U5.19
GPS_SDA2
  Top 0.254: U5.18 90.34,22.53 87.65,19.84 U3.5
GPS_TIMEPULSE
  Top 0.254: 95.93,34.66 U5.3 95.8,35.73 96.14,36.07 97.66,36.07 97.86,36.26 R8.1
GPS_VCC_RF
  Top 0.61: R7.1 90.16,38.54 90.16,36.52 88.4,34.77 U5.8 U5.9
LORA_ANT
  Top 1.016: U4.ANT LORA_ANT.1 LORA_U.FL.2
N$2
  Top 1.016: POWER.1 83.94,15.68 D1.A
N$5
  Top 0.254: IO4.A 30.23,21.65 R3.1
N$10
  Top 0.254: R4.1 88.66,13.91 88.66,12.05 PWR.A
N$14
  Top 0.254: R8.2 95.92,37.55 94.52,37.55 GPS_LOCK.A
N$16
  Top 0.61: L1.2 R7.2
N$17
  Top 0.254: R10.2 92.48,18.96 D2.C
V_BCKP
  Top 0.254: U5.22 95.55,22.27 95.55,21.34 94.31,20.11 94.31,17.83 | 94.31,17.83 94.31,13.86 92.76,12.31 MS621FE.+ | R10.1 94.31,17.83

### Text on the board
tPlace: GND | 21 | 22 | TXD0 | RXD0 | MOSI3 | MISO3 | SCLK3 | 4 | 0 | 2 | 15 | GND | 3V3 | STRAPPING | COMMUNICATION | GND | TXD0 | RXD0 | 3V3 | RST | IO0 | EROL T. | JLCJLCJLCJLC | NEO-6M | SX1278 / MODULE | ETF SA. / 2021. | ESP-32 WROOM | GND | 3V3 | 14 | LORA | ESP | INPUT ONLY | + VIN - | NC | 12 | 15 | 13 | RST | 36 | 39 | 34 | 35 | 33 | 25 | 26 | 14 | 12 | 13 | GND | 3V3 | GPS | ESP | 4.5V-6V | TX / RX | IO16 / IO17 | IO0 / RST / MISO / MOSI / SCLK / SEL | IO27 / IO32 / IO19 / IO23 / IO18 / IO5
tDocu: (MISO) | (MOSI)
_tNames: R1 | RESET | BOOT | L1 | IO4_LED | R7 | R8 | GPS_LOCK | R3 | PROG | R5 | R6 | C11 | C6 | D1 | C10 | D2 | R10 | C5 | C9 | C2 | C1 | R4 | C4 | JTAG | R2 | C3 | MS621FE | C8